# Altium schematic sheet FPGA_PortSwitcher.SchDoc
size A4; Organization: Altium Limited; Address1: L3, 12a Rodborough Rd; Address2: Frenchs Forest; Address3: NSW; Address4: Australia 2086; DocumentNumber: 1; SheetNumber: 1; SheetTotal: 4
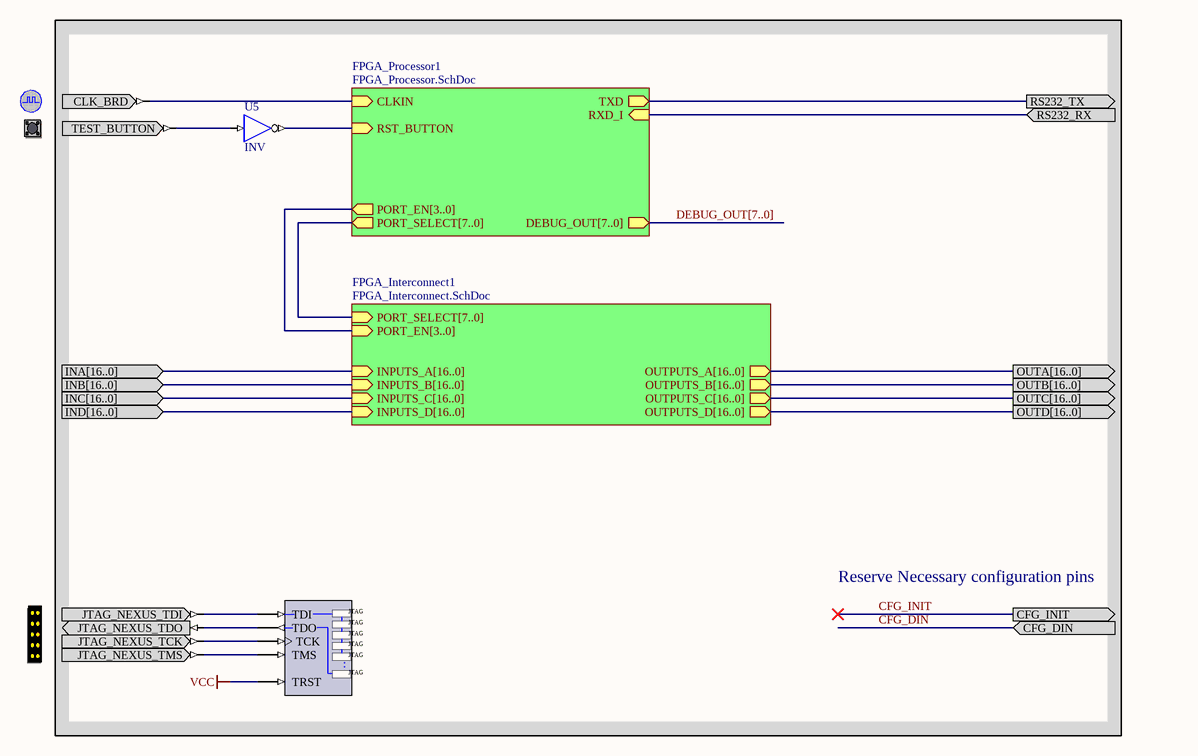
[diagram p0: FPGA_PortSwitcher.SchDoc]

## Parts
(Parts that share a designator on the sheet are numbered #1, #2 ... from top to bottom, then left to right.)
?#1  CLOCK_BOARD  (value not drawn)
?#2  TEST_BUTTON  (value not drawn)
?#3  NEXUS_JTAG_CONNECTOR  (value not drawn)
NEXUS_JTAG_PORT  NEXUS_JTAG_PORT  (value not drawn)
U5  INV

## Blocks framed on the sheet
Reserve Necessary configuration pins: ?#1-?#3 NEXUS_JTAG_PORT U5

## Sub-sheets
FPGA_Interconnect1 = FPGA_Interconnect.SchDoc: PORT_SELECT[7..0] (in), OUTPUTS_D[16..0] (out), OUTPUTS_C[16..0] (out), OUTPUTS_B[16..0] (out), OUTPUTS_A[16..0] (out), PORT_EN[3..0] (in), INPUTS_A[16..0] (in), INPUTS_B[16..0] (in), INPUTS_C[16..0] (in), INPUTS_D[16..0] (in)
FPGA_Processor1 = FPGA_Processor.SchDoc: TXD (out), RXD_I (in), CLKIN (in), RST_BUTTON (in), PORT_SELECT[7..0] (out), PORT_EN[3..0] (out), DEBUG_OUT[7..0] (out)

## Ports
CFG_DIN (in), CFG_INIT (out), INA[16..0] (in), INB[16..0] (in), INC[16..0] (in), IND[16..0] (in), OUTA[16..0] (out), OUTB[16..0] (out), OUTC[16..0] (out), OUTD[16..0] (out), RS232_RX (in), RS232_TX (out)

## Nets
VCC: NEXUS_JTAG_PORT.TRST
CFG_DIN: port CFG_DIN
CFG_INIT: port CFG_INIT
RS232_RX: port RS232_RX, sheet FPGA_Processor1/RXD_I
RS232_TX: port RS232_TX, sheet FPGA_Processor1/TXD
Net?#1_CLK_BRD: ?#1.CLK_BRD ; sheet FPGA_Processor1/CLKIN
Net?#2_TEST_BUTTON: ?#2.TEST_BUTTON U5.I
Net?#3_JTAG_NEXUS_TCK: ?#3.JTAG_NEXUS_TCK NEXUS_JTAG_PORT.TCK
Net?#3_JTAG_NEXUS_TDI: ?#3.JTAG_NEXUS_TDI NEXUS_JTAG_PORT.TDI
Net?#3_JTAG_NEXUS_TDO: ?#3.JTAG_NEXUS_TDO NEXUS_JTAG_PORT.TDO
Net?#3_JTAG_NEXUS_TMS: ?#3.JTAG_NEXUS_TMS NEXUS_JTAG_PORT.TMS
NetU5_O: U5.O ; sheet FPGA_Processor1/RST_BUTTON

## Buses and harness runs
bus DEBUG_OUT[7..0] = sheet FPGA_Processor1/DEBUG_OUT[7..0]
bus port INA[16..0] = sheet FPGA_Interconnect1/INPUTS_A[16..0]
bus port INB[16..0] = sheet FPGA_Interconnect1/INPUTS_B[16..0]
bus port INC[16..0] = sheet FPGA_Interconnect1/INPUTS_C[16..0]
bus port IND[16..0] = sheet FPGA_Interconnect1/INPUTS_D[16..0]
bus port OUTA[16..0] = sheet FPGA_Interconnect1/OUTPUTS_A[16..0]
bus port OUTB[16..0] = sheet FPGA_Interconnect1/OUTPUTS_B[16..0]
bus port OUTC[16..0] = sheet FPGA_Interconnect1/OUTPUTS_C[16..0]
bus port OUTD[16..0] = sheet FPGA_Interconnect1/OUTPUTS_D[16..0]
bus sheet FPGA_Interconnect1/PORT_EN[3..0] = sheet FPGA_Processor1/PORT_EN[3..0]
bus sheet FPGA_Interconnect1/PORT_SELECT[7..0] = sheet FPGA_Processor1/PORT_SELECT[7..0]

## Notes on the sheet
- Title
- Size:
- Date:
- A4
- Number:
- Time:
- Revision:
- Sheet
- of
- File:
- (in symbol NEXUS_JTAG_PORT) JTAG; .

## Library data of the parts
?#1 = CLOCK_BOARD: Global System Clock Supply; PortComponent: True; Published: 19-Nov-2003; Publisher: Altium Limited
?#2 = TEST_BUTTON: Test Button; PortComponent: True; Published: 19-Nov-2003; Publisher: Altium Limited
?#3 = NEXUS_JTAG_CONNECTOR: JTAG Port; PortComponent: True; Published: 19-Nov-2003; Publisher: Altium Limited
NEXUS_JTAG_PORT = NEXUS_JTAG_PORT: Soft Nexus-Chain Connector; NEXUS_JTAG_CONNECTOR: True; Published: 18-Dec-2003; Publisher: Altium Limited
U5 = INV: Inverter; ArchiveName: GENERIC; Published: 18-Dec-2003; Publisher: Altium Limited; Xilinx Equivalent: INV; Core Revision: 1.00.00